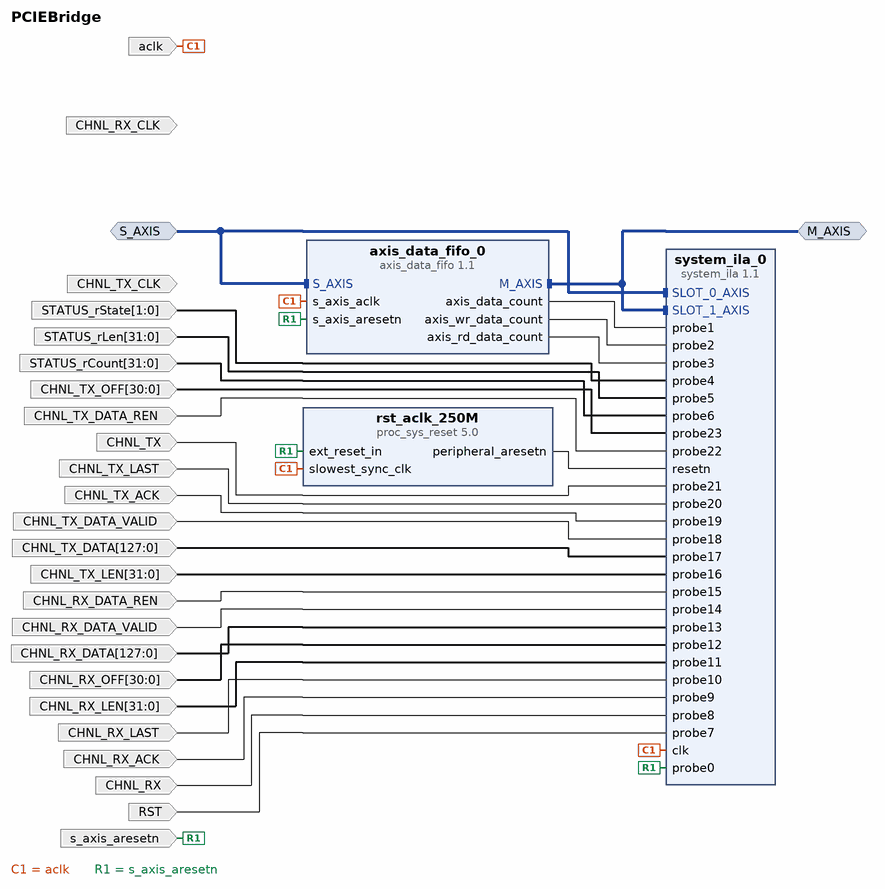
[diagram p0: block diagram of the top level]
# Vivado block design PCIEBridge, xc7k325tffg900-2, Vivado 2018.1
create_bd_design PCIEBridge

create_bd_intf_port -mode Slave -vlnv xilinx.com:interface:axis_rtl:1.0 S_AXIS
set_property -dict [list \
  CONFIG.TDATA_NUM_BYTES 16 \
  CONFIG.TDEST_WIDTH 0 \
  CONFIG.TID_WIDTH 0 \
  CONFIG.TUSER_WIDTH 0 \
  CONFIG.HAS_TREADY 1 \
  CONFIG.HAS_TSTRB 0 \
  CONFIG.HAS_TKEEP 0 \
  CONFIG.HAS_TLAST 0 \
  CONFIG.FREQ_HZ 250000000 \
  CONFIG.LAYERED_METADATA undef \
] [get_bd_intf_ports S_AXIS]
create_bd_intf_port -mode Master -vlnv xilinx.com:interface:axis_rtl:1.0 M_AXIS
set_property -dict {CONFIG.FREQ_HZ 250000000} [get_bd_intf_ports M_AXIS]
create_bd_port -dir I -type clk aclk
set_property -dict {CONFIG.FREQ_HZ 250000000} [get_bd_ports aclk]
create_bd_port -dir I -type rst s_axis_aresetn
create_bd_port -dir I -from 1 -to 0 STATUS_rState
create_bd_port -dir I -from 31 -to 0 STATUS_rLen
create_bd_port -dir I -from 31 -to 0 STATUS_rCount
create_bd_port -dir I RST
create_bd_port -dir I CHNL_RX
create_bd_port -dir I CHNL_RX_ACK
create_bd_port -dir I CHNL_RX_LAST
create_bd_port -dir I -from 31 -to 0 CHNL_RX_LEN
create_bd_port -dir I -from 30 -to 0 CHNL_RX_OFF
create_bd_port -dir I -from 127 -to 0 CHNL_RX_DATA
create_bd_port -dir I CHNL_RX_DATA_VALID
create_bd_port -dir I CHNL_RX_DATA_REN
create_bd_port -dir I CHNL_TX
create_bd_port -dir I CHNL_TX_ACK
create_bd_port -dir I CHNL_TX_LAST
create_bd_port -dir I -from 31 -to 0 CHNL_TX_LEN
create_bd_port -dir I -from 30 -to 0 CHNL_TX_OFF
create_bd_port -dir I -from 127 -to 0 CHNL_TX_DATA
create_bd_port -dir I CHNL_TX_DATA_VALID
create_bd_port -dir I CHNL_TX_DATA_REN
create_bd_port -dir I CHNL_RX_CLK
create_bd_port -dir I CHNL_TX_CLK

create_bd_cell -type ip -vlnv xilinx.com:ip:axis_data_fifo:1.1 axis_data_fifo_0
set_property -dict {CONFIG.TDATA_NUM_BYTES 16} [get_bd_cells axis_data_fifo_0]
create_bd_cell -type ip -vlnv xilinx.com:ip:system_ila:1.1 system_ila_0
set_property -dict [list \
  CONFIG.C_SLOT_0_APC_EN 0 \
  CONFIG.C_SLOT_1_APC_EN 0 \
  CONFIG.C_SLOT_0_AXI_DATA_SEL 1 \
  CONFIG.C_SLOT_1_AXI_DATA_SEL 1 \
  CONFIG.C_SLOT_0_AXI_TRIG_SEL 1 \
  CONFIG.C_SLOT_1_AXI_TRIG_SEL 1 \
  CONFIG.C_PROBE6_TYPE 0 \
  CONFIG.C_PROBE5_TYPE 0 \
  CONFIG.C_PROBE4_TYPE 0 \
  CONFIG.C_PROBE3_TYPE 0 \
  CONFIG.C_PROBE2_TYPE 0 \
  CONFIG.C_PROBE1_TYPE 0 \
  CONFIG.C_PROBE0_TYPE 0 \
  CONFIG.C_PROBE23_WIDTH 31 \
  CONFIG.C_PROBE17_WIDTH 128 \
  CONFIG.C_PROBE16_WIDTH 32 \
  CONFIG.C_PROBE13_WIDTH 128 \
  CONFIG.C_PROBE12_WIDTH 31 \
  CONFIG.C_PROBE11_WIDTH 32 \
  CONFIG.C_PROBE6_WIDTH 32 \
  CONFIG.C_PROBE5_WIDTH 32 \
  CONFIG.C_PROBE4_WIDTH 2 \
  CONFIG.C_PROBE3_WIDTH 32 \
  CONFIG.C_PROBE2_WIDTH 32 \
  CONFIG.C_PROBE1_WIDTH 32 \
  CONFIG.C_NUM_OF_PROBES 24 \
  CONFIG.C_NUM_MONITOR_SLOTS 2 \
  CONFIG.C_SLOT_0_INTF_TYPE xilinx.com:interface:axis_rtl:1.0 \
  CONFIG.C_SLOT_1_INTF_TYPE xilinx.com:interface:axis_rtl:1.0 \
  CONFIG.C_MON_TYPE MIX \
  CONFIG.C_PROBE_WIDTH_PROPAGATION MANUAL \
] [get_bd_cells system_ila_0]
create_bd_cell -type ip -vlnv xilinx.com:ip:proc_sys_reset:5.0 rst_aclk_250M

# ---- connections ----

connect_bd_intf_net [get_bd_intf_ports S_AXIS] [get_bd_intf_pins axis_data_fifo_0/S_AXIS]
connect_bd_intf_net [get_bd_intf_ports S_AXIS] [get_bd_intf_pins system_ila_0/SLOT_0_AXIS]
connect_bd_intf_net [get_bd_intf_ports M_AXIS] [get_bd_intf_pins axis_data_fifo_0/M_AXIS]
connect_bd_intf_net [get_bd_intf_ports M_AXIS] [get_bd_intf_pins system_ila_0/SLOT_1_AXIS]
connect_bd_net [get_bd_ports aclk] \
  [get_bd_pins axis_data_fifo_0/s_axis_aclk] [get_bd_pins system_ila_0/clk] [get_bd_pins rst_aclk_250M/slowest_sync_clk]
connect_bd_net [get_bd_ports s_axis_aresetn] \
  [get_bd_pins axis_data_fifo_0/s_axis_aresetn] [get_bd_pins system_ila_0/probe0] [get_bd_pins rst_aclk_250M/ext_reset_in]
connect_bd_net -net axis_data_count [get_bd_pins axis_data_fifo_0/axis_data_count] [get_bd_pins system_ila_0/probe1]
connect_bd_net -net axis_wr_data_count [get_bd_pins axis_data_fifo_0/axis_wr_data_count] [get_bd_pins system_ila_0/probe2]
connect_bd_net -net axis_rd_data_count [get_bd_pins axis_data_fifo_0/axis_rd_data_count] [get_bd_pins system_ila_0/probe3]
connect_bd_net [get_bd_ports STATUS_rState] [get_bd_pins system_ila_0/probe4]
connect_bd_net [get_bd_ports STATUS_rLen] [get_bd_pins system_ila_0/probe5]
connect_bd_net [get_bd_ports STATUS_rCount] [get_bd_pins system_ila_0/probe6]
connect_bd_net [get_bd_pins rst_aclk_250M/peripheral_aresetn] [get_bd_pins system_ila_0/resetn]
connect_bd_net [get_bd_ports CHNL_TX_OFF] [get_bd_pins system_ila_0/probe23]
connect_bd_net [get_bd_ports CHNL_TX_DATA_REN] [get_bd_pins system_ila_0/probe22]
connect_bd_net [get_bd_ports CHNL_TX] [get_bd_pins system_ila_0/probe21]
connect_bd_net [get_bd_ports CHNL_TX_LAST] [get_bd_pins system_ila_0/probe20]
connect_bd_net [get_bd_ports CHNL_TX_ACK] [get_bd_pins system_ila_0/probe19]
connect_bd_net [get_bd_ports CHNL_TX_DATA_VALID] [get_bd_pins system_ila_0/probe18]
connect_bd_net [get_bd_ports CHNL_TX_DATA] [get_bd_pins system_ila_0/probe17]
connect_bd_net [get_bd_ports CHNL_TX_LEN] [get_bd_pins system_ila_0/probe16]
connect_bd_net [get_bd_ports CHNL_RX_DATA_REN] [get_bd_pins system_ila_0/probe15]
connect_bd_net [get_bd_ports CHNL_RX_DATA_VALID] [get_bd_pins system_ila_0/probe14]
connect_bd_net [get_bd_ports CHNL_RX_DATA] [get_bd_pins system_ila_0/probe13]
connect_bd_net [get_bd_ports CHNL_RX_OFF] [get_bd_pins system_ila_0/probe12]
connect_bd_net [get_bd_ports CHNL_RX_LEN] [get_bd_pins system_ila_0/probe11]
connect_bd_net [get_bd_ports CHNL_RX_LAST] [get_bd_pins system_ila_0/probe10]
connect_bd_net [get_bd_ports CHNL_RX_ACK] [get_bd_pins system_ila_0/probe9]
connect_bd_net [get_bd_ports CHNL_RX] [get_bd_pins system_ila_0/probe8]
connect_bd_net [get_bd_ports RST] [get_bd_pins system_ila_0/probe7]

validate_bd_design
save_bd_design
